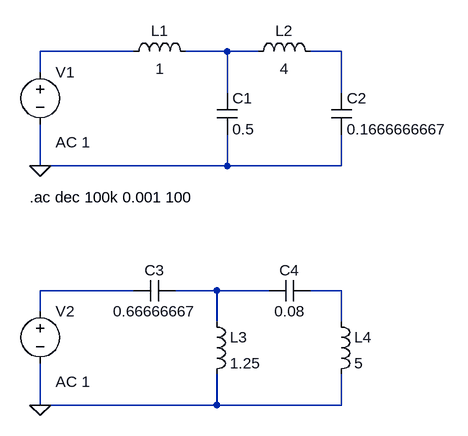
[diagram p0: schematic 1-Cauer.asc]
1-Cauer.asc, the LTspice schematic file:
Version 4
SHEET 1 880 740
WIRE 144 176 0 176
WIRE 288 176 224 176
WIRE 336 176 288 176
WIRE 464 176 416 176
WIRE 0 208 0 176
WIRE 288 240 288 176
WIRE 464 240 464 176
WIRE 0 352 0 288
WIRE 288 352 288 304
WIRE 288 352 0 352
WIRE 464 352 464 304
WIRE 464 352 288 352
WIRE 144 544 0 544
WIRE 272 544 208 544
WIRE 352 544 272 544
WIRE 464 544 416 544
WIRE 0 576 0 544
WIRE 272 592 272 544
WIRE 464 592 464 544
WIRE 0 720 0 656
WIRE 272 720 272 672
WIRE 272 720 0 720
WIRE 464 720 464 672
WIRE 464 720 272 720
FLAG 0 352 0
FLAG 0 720 0
SYMBOL voltage 0 192 R0
WINDOW 123 24 124 Left 2
WINDOW 39 0 0 Left 0
SYMATTR Value2 AC 1
SYMATTR InstName V1
SYMATTR Value ""
SYMBOL ind 128 192 R270
WINDOW 0 32 56 VTop 2
WINDOW 3 5 56 VBottom 2
SYMATTR InstName L1
SYMATTR Value 1
SYMBOL ind 320 192 R270
WINDOW 0 32 56 VTop 2
WINDOW 3 5 56 VBottom 2
SYMATTR InstName L2
SYMATTR Value 4
SYMBOL cap 272 240 R0
SYMATTR InstName C1
SYMATTR Value 0.5
SYMBOL cap 448 240 R0
SYMATTR InstName C2
SYMATTR Value 0.1666666667
SYMBOL voltage 0 560 R0
WINDOW 123 24 124 Left 2
WINDOW 39 0 0 Left 0
SYMATTR Value2 AC 1
SYMATTR InstName V2
SYMATTR Value ""
SYMBOL cap 208 528 R90
WINDOW 0 0 32 VBottom 2
WINDOW 3 32 32 VTop 2
SYMATTR InstName C3
SYMATTR Value 0.66666667
SYMBOL cap 416 528 R90
WINDOW 0 0 32 VBottom 2
WINDOW 3 32 32 VTop 2
SYMATTR InstName C4
SYMATTR Value 0.08
SYMBOL ind 256 576 R0
SYMATTR InstName L3
SYMATTR Value 1.25
SYMBOL ind 448 576 R0
SYMATTR InstName L4
SYMATTR Value 5
TEXT -16 400 Left 2 !.ac dec 100k 0.001 100

The netlist it stands for:
* 1-Cauer.asc
V1 N001 0 AC 1
L1 N001 N002 1
L2 N002 N003 4
C1 N002 0 0.5
C2 N003 0 0.1666666667
V2 N004 0 AC 1
C3 N005 N004 0.66666667
C4 N006 N005 0.08
L3 N005 0 1.25
L4 N006 0 5
.ac dec 100k 0.001 100
.backanno
.end